# Altium schematic sheet reflex_beta.SchDoc
size C; PageSetup: Record=PageOptions|CenterHorizontal=True|CenterVertical=True|PrintScale=0.53|XCorrection=1.00|YCorrection=1.00|PrintKind=0|BorderSize=5000000|LeftOffset=0|BottomOffset=0|Orientation=2|PaperLength=1000|PaperWidth=1000|Scale=100|PaperSource=7|PrintQuality=-4|MediaType=1|DitherType=10|PrintScaleMode=1|PaperKind=Letter|PaperIndex=1
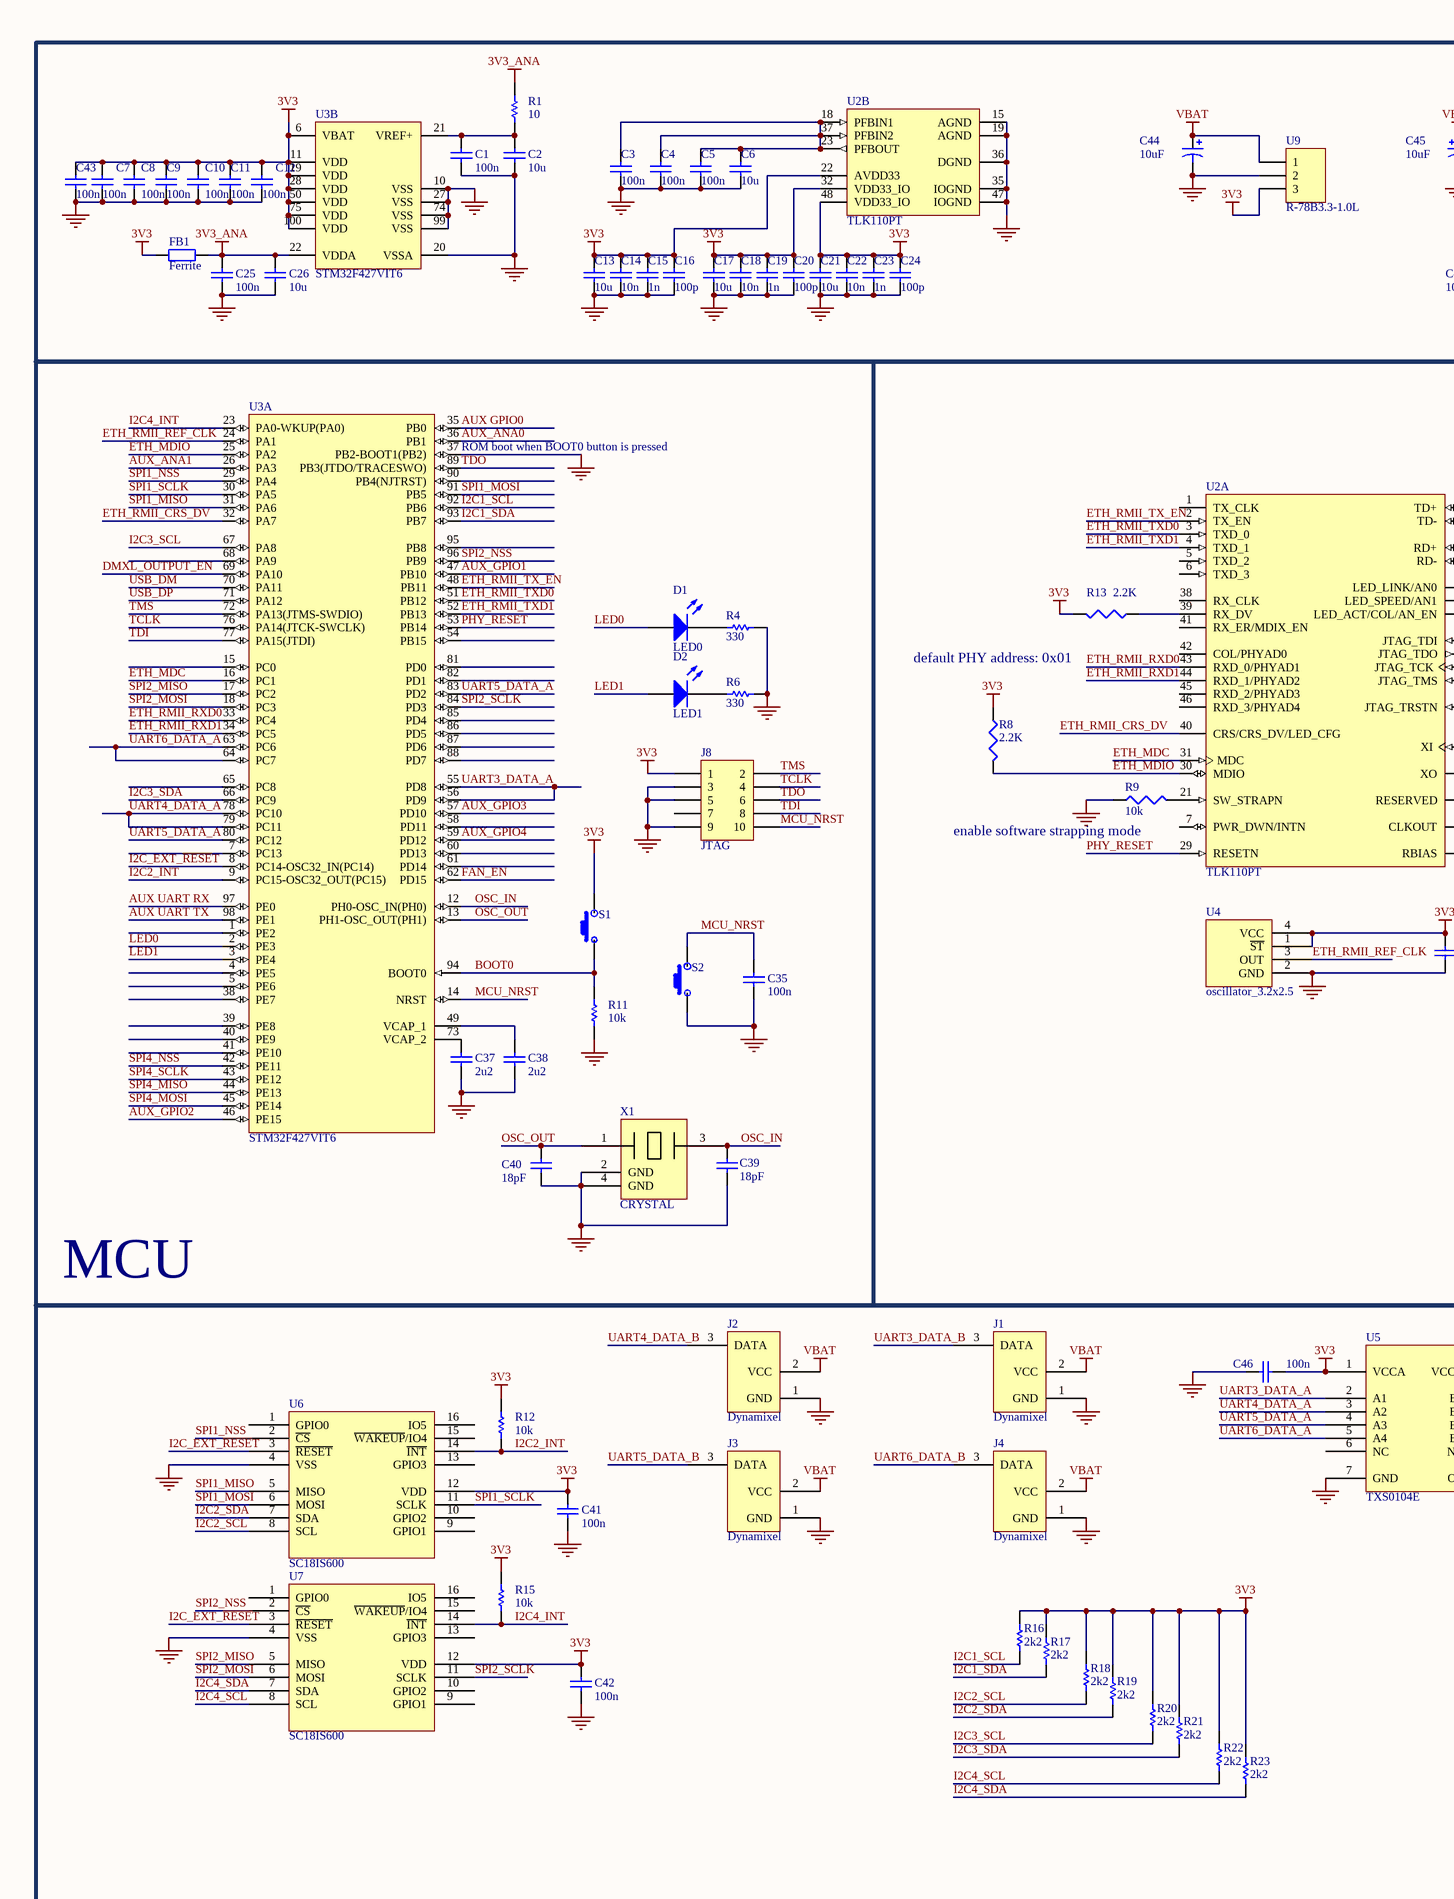
[diagram p0: reflex_beta.SchDoc, left]
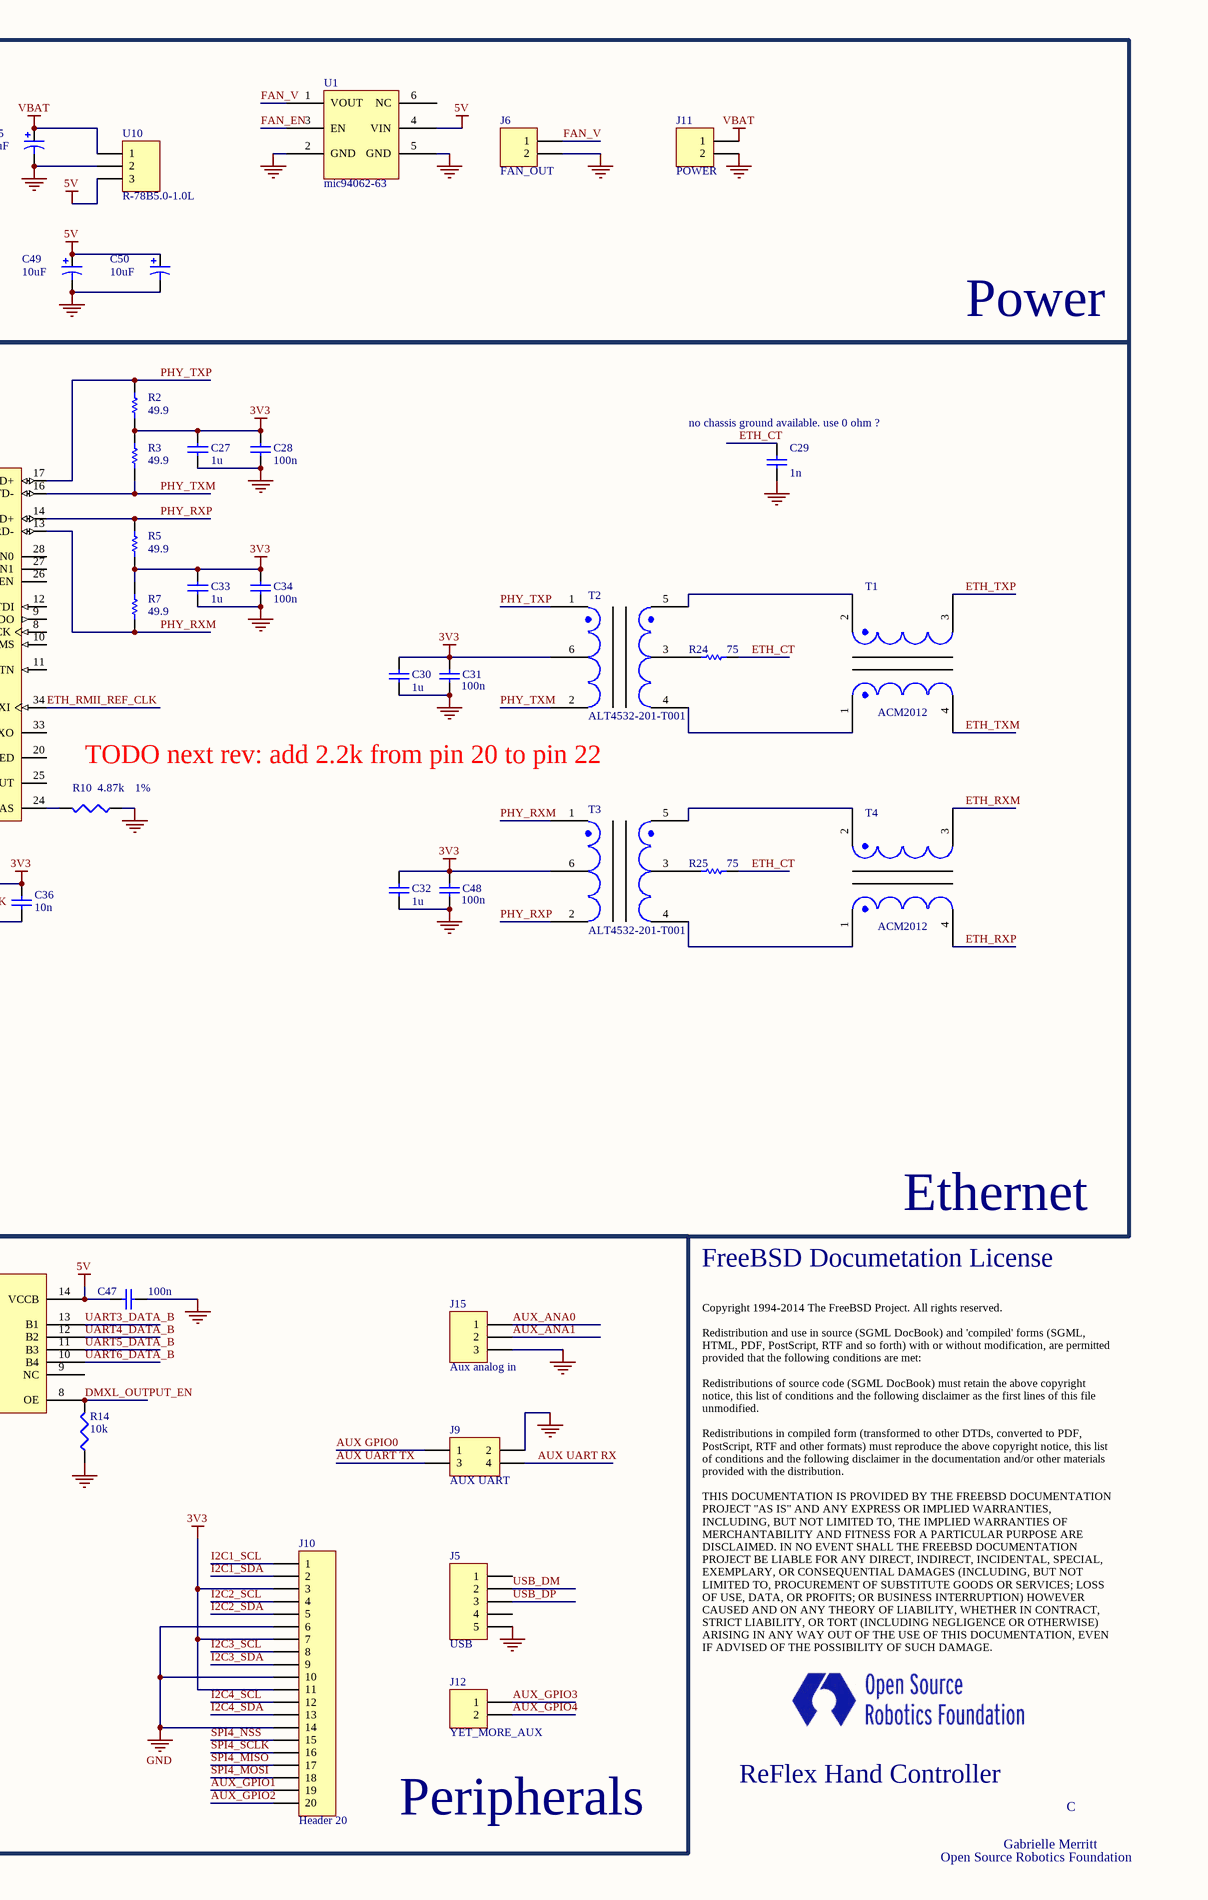
[diagram p1: reflex_beta.SchDoc, right]

## Parts
(Parts that share a designator on the sheet are numbered #1, #2 ... from top to bottom, then left to right.)
C1  value 100n  [GENERIC_0603]  (hidden comment: Cap)
C2  value 10u  [GENERIC_0603]  (hidden comment: Cap)
C3  value 100n  [GENERIC_0603]  (hidden comment: Cap)
C4  value 100n  [GENERIC_0603]  (hidden comment: Cap)
C5  value 100n  [GENERIC_0603]  (hidden comment: Cap)
C6  value 10u  [GENERIC_0603]  (hidden comment: Cap)
C7  value 100n  [GENERIC_0603]  (hidden comment: Cap)
C8  value 100n  [GENERIC_0603]  (hidden comment: Cap)
C9  value 100n  [GENERIC_0603]  (hidden comment: Cap)
C10  value 100n  [GENERIC_0603]  (hidden comment: Cap)
C11  value 100n  [GENERIC_0603]  (hidden comment: Cap)
C12  value 100n  [GENERIC_0603]  (hidden comment: Cap)
C13  value 10u  [GENERIC_0603]  (hidden comment: Cap)
C14  value 10n  [GENERIC_0603]  (hidden comment: Cap)
C15  value 1n  [GENERIC_0603]  (hidden comment: Cap)
C16  value 100p  [GENERIC_0603]  (hidden comment: Cap)
C17  value 10u  [GENERIC_0603]  (hidden comment: Cap)
C18  value 10n  [GENERIC_0603]  (hidden comment: Cap)
C19  value 1n  [GENERIC_0603]  (hidden comment: Cap)
C20  value 100p  [GENERIC_0603]  (hidden comment: Cap)
C21  value 10u  [GENERIC_0603]  (hidden comment: Cap)
C22  value 10n  [GENERIC_0603]  (hidden comment: Cap)
C23  value 1n  [GENERIC_0603]  (hidden comment: Cap)
C24  value 100p  [GENERIC_0603]  (hidden comment: Cap)
C25  value 100n  [GENERIC_0603]  (hidden comment: Cap)
C26  value 10u  [GENERIC_0603]  (hidden comment: Cap)
C27  value 1u  [GENERIC_0603]  (hidden comment: Cap)
C28  value 100n  [GENERIC_0603]  (hidden comment: Cap)
C29  value 1n  [GENERIC_0805]  (hidden comment: Cap)
C30  value 1u  [GENERIC_0402]  (hidden comment: Cap)
C31  value 100n  [GENERIC_0402]  (hidden comment: Cap)
C32  value 1u  [GENERIC_0402]  (hidden comment: Cap)
C33  value 1u  [GENERIC_0603]  (hidden comment: Cap)
C34  value 100n  [GENERIC_0603]  (hidden comment: Cap)
C35  value 100n  [GENERIC_0603]  (hidden comment: Cap)
C36  value 10n  [CAPC0402(1005)60_N]  (hidden comment: CAP 10nF 16V 0402(1005))
C37  value 2u2  [GENERIC_0603]  (hidden comment: Cap)
C38  value 2u2  [GENERIC_0603]  (hidden comment: Cap)
C39  value 18pF  [GENERIC_0603]  (hidden comment: Cap)
C40  value 18pF  [GENERIC_0603]  (hidden comment: Cap)
C41  value 100n  [GENERIC_0603]  (hidden comment: Cap)
C42  value 100n  [GENERIC_0603]  (hidden comment: Cap)
C43  value 100n  [GENERIC_0603]  (hidden comment: Cap)
C44  value 10uF  [GENERIC_0805]  (hidden comment: Cap Pol1)
C45  value 10uF  [GENERIC_0805]  (hidden comment: Cap Pol1)
C46  value 100n  [GENERIC_0603]  (hidden comment: Cap)
C47  value 100n  [GENERIC_0603]  (hidden comment: Cap)
C48  value 100n  [GENERIC_0402]  (hidden comment: Cap)
C49  value 10uF  [GENERIC_0805]  (hidden comment: Cap Pol1)
C50  value 10uF  [GENERIC_0805]  (hidden comment: Cap Pol1)
D1  LED0  [GENERIC_0603]
D2  LED1  [GENERIC_0603]
FB1  Ferrite  [GENERIC_0603]
J1  Dynamixel  [molex_3pos_header]
J2  Dynamixel  [molex_3pos_header]
J3  Dynamixel  [molex_3pos_header]
J4  Dynamixel  [molex_3pos_header]
J5  USB  [FCI-10104110]
J6  FAN_OUT  [HDR1X2]
J8  JTAG  [CNCTECH_3220-10-0300-00]
J9  AUX UART  [HDR2X2]
J10  Header 20  [20pos_halfmm_vert]
J11  POWER  [HDR1X2]
J12  YET_MORE_AUX  [HDR1X2]
J15  Aux analog in  [HDR1X3]
R1  value 10  [GENERIC_0603]  (hidden comment: Res1)
R2  value 49.9  [GENERIC_0603]  (hidden comment: Res1)
R3  value 49.9  [GENERIC_0603]  (hidden comment: Res1)
R4  value 330  [GENERIC_0603]  (hidden comment: Res1)
R5  value 49.9  [GENERIC_0603]  (hidden comment: Res1)
R6  value 330  [GENERIC_0603]  (hidden comment: Res1)
R7  value 49.9  [GENERIC_0603]  (hidden comment: Res1)
R8  value 2.2K  [J1-0603]
R9  value 10k  [J1-0603]
R10  1%  value 4.87k  [GENERIC_0603]
R11  value 10k  [GENERIC_0603]  (hidden comment: Res1)
R12  value 10k  [GENERIC_0603]  (hidden comment: Res1)
R13  value 2.2K  [J1-0603]
R14  value 10k  [GENERIC_0603]
R15  value 10k  [GENERIC_0603]  (hidden comment: Res1)
R16  value 2k2  [GENERIC_0402]  (hidden comment: Res1)
R17  value 2k2  [GENERIC_0402]  (hidden comment: Res1)
R18  value 2k2  [GENERIC_0402]  (hidden comment: Res1)
R19  value 2k2  [GENERIC_0402]  (hidden comment: Res1)
R20  value 2k2  [GENERIC_0402]  (hidden comment: Res1)
R21  value 2k2  [GENERIC_0402]  (hidden comment: Res1)
R22  value 2k2  [GENERIC_0402]  (hidden comment: Res1)
R23  value 2k2  [GENERIC_0402]  (hidden comment: Res1)
R24  value 75  [RESC0402(1005)_L]  (hidden comment: 75R 5% 0402(1005))
R25  value 75  [RESC0402(1005)_L]  (hidden comment: 75R 5% 0402(1005))
S1  Component_1  [EVPAA402_switch]  (value not drawn)
S2  Component_1  [EVPAA402_switch]  (value not drawn)
T1  ACM2012  [ACM2012]
T2  ALT4532-201-T001  [ALT4532-201-T001]
T3  ALT4532-201-T001  [ALT4532-201-T001]
T4  ACM2012  [ACM2012]
U1  mic94062-63  [mic94062-63 sc-70-6]
U2#1  TLK110PT  [TI-PT48_M]  (part B of 2)
U2#2  TLK110PT  [TI-PT48_M]  (part A of 2)
U3  STM32F427VIT6  [STM-LQFP100_N]  (parts A,B of 2)
U4  oscillator_3.2x2.5  [OSCILLATOR_3.2x2.5]
U5  TXS0104E  [TXS0104EPWR]
U6  SC18IS600  [SOP127P600-8N]
U7  SC18IS600  [SOP127P600-8N]
U9  R-78B3.3-1.0L  [R-78HBxx-0.5_HORIZ]
U10  R-78B5.0-1.0L  [R-78HBxx-0.5_HORIZ]
X1  CRYSTAL  [CRYSTAL_2_2.5]

## Blocks framed on the sheet
Power: C1-C26 C43-C45 C49 C50 FB1 J6 J11 R1 U1 U2#1 U3 U9 U10
Ethernet: C27-C34 C36 C48 R2 R3 R5 R7-R10 R13 R24 R25 T1-T4 U2#2 U4
MCU: C35 C37-C40 D1 D2 J8 R4 R6 R11 S1 S2 U3 X1
Peripherals: C41 C42 C46 C47 J1-J5 J9 J10 J12 J15 R12 R14-R23 U5-U7

## Nets
3V3: C7.2 C8.2 C9.2 C10.2 C11.2 C12.2 C13.2 C14.2 C15.2 C16.2 C17.2 C18.2 C19.2 C20.2 C21.2 C22.2 C23.2 C24.2 C27.2 C28.2 C30.2 C31.2 C32.2 C33.2 C34.2 C36.2 C41.2 C42.2 C43.2 C46.1 C48.2 FB1.1 J8.1 J10.3 J10.7 J10.11 R2.1 R3.2 R5.1 R7.2 R8.1 R12.2 R13.2 R15.2 R16.2 R17.2 R18.2 R19.2 R20.2 R21.2 R22.2 R23.2 S1.1 T2.6 T3.6 U2#1.22(AVDD33) U2#1.32(VDD33_IO) U2#1.48(VDD33_IO) U3.6(VBAT) U3.11(VDD) U3.19(VDD) U3.28(VDD) U3.50(VDD) U3.75(VDD) U3.100(VDD) U4.1(~{ST}) U4.4(VCC) U5.1(VCCA) U6.12(VDD) U7.12(VDD) U9.3
3V3_ANA: C25.2 C26.2 FB1.2 R1.2 U3.22(VDDA)
5V: C47.2 C49.1 C50.1 U1.4(VIN) U5.14(VCCB) U10.3
GND: C1.1 C2.1 C3.2 C4.1 C5.1 C6.1 C7.1 C8.1 C9.1 C10.1 C11.1 C12.1 C13.1 C14.1 C15.1 C16.1 C17.1 C18.1 C19.1 C20.1 C21.1 C22.1 C23.1 C24.1 C25.1 C26.1 C27.1 C28.1 C29.1 C30.1 C31.1 C32.1 C33.1 C34.1 C35.1 C36.1 C37.1 C38.1 C39.2 C40.2 C41.1 C42.1 C43.1 C44.2 C45.2 C46.2 C47.1 C48.1 C49.2 C50.2 J1.1(GND) J2.1(GND) J3.1(GND) J4.1(GND) J5.5 J6.2 J8.3 J8.5 J8.9 J9.2 J10.6 J10.10 J10.14 J11.2 J15.3 R4.1 R6.1 R9.1 R10.1 R11.1 R14.1 S2.2 U1.2(GND) U1.5(GND) U2#1.15(AGND) U2#1.19(AGND) U2#1.35(IOGND) U2#1.36(DGND) U2#1.47(IOGND) U3.10(VSS) U3.20(VSSA) U3.27(VSS) U3.37(PB2-BOOT1(PB2)) U3.74(VSS) U3.99(VSS) U4.2(GND) U5.7(GND) U6.4(VSS) U7.4(VSS) U9.2 U10.2 X1.2(GND) X1.4(GND)
VBAT: C44.1 C45.1 J1.2(VCC) J2.2(VCC) J3.2(VCC) J4.2(VCC) J11.1 U9.1 U10.1
AUX GPIO0: J9.1 U3.35(PB0)
AUX UART RX: J9.4 U3.97(PE0)
AUX UART TX: J9.3 U3.98(PE1)
AUX_ANA0: J15.1 U3.36(PB1)
AUX_ANA1: J15.2 U3.26(PA3)
AUX_GPIO1: J10.19 U3.47(PB10)
AUX_GPIO2: J10.20 U3.46(PE15)
AUX_GPIO3: J12.1 U3.57(PD10)
AUX_GPIO4: J12.2 U3.59(PD12)
BOOT0: R11.2 S1.2 U3.94(BOOT0)
DMXL_OUTPUT_EN: R14.2 U3.69(PA10) U5.8(OE)
ETH_CT: C29.2 R24.2 R25.2
ETH_MDC: U2#2.31(MDC) U3.16(PC1)
ETH_MDIO: R8.2 U2#2.30(MDIO) U3.25(PA2)
ETH_RMII_CRS_DV: U2#2.40(CRS/CRS_DV/LED_CFG) U3.32(PA7)
ETH_RMII_REF_CLK: U2#2.34(XI) U3.24(PA1) U4.3(OUT)
ETH_RMII_RXD0: U2#2.43(RXD_0/PHYAD1) U3.33(PC4)
ETH_RMII_RXD1: U2#2.44(RXD_1/PHYAD2) U3.34(PC5)
ETH_RMII_TX_EN: U2#2.2(TX_EN) U3.48(PB11)
ETH_RMII_TXD0: U2#2.3(TXD_0) U3.51(PB12)
ETH_RMII_TXD1: U2#2.4(TXD_1) U3.52(PB13)
ETH_RXM: T4.3
ETH_RXP: T4.4
ETH_TXM: T1.4
ETH_TXP: T1.3
FAN_EN: U1.3(EN) U3.62(PD15)
FAN_V: J6.1 U1.1(VOUT)
I2C1_SCL: J10.1 R16.1 U3.92(PB6)
I2C1_SDA: J10.2 R17.1 U3.93(PB7)
I2C2_INT: R12.1 U3.9(PC15-OSC32_OUT(PC15)) U6.14(~{INT})
I2C2_SCL: J10.4 R18.1 U6.8(SCL)
I2C2_SDA: J10.5 R19.1 U6.7(SDA)
I2C3_SCL: J10.8 R20.1 U3.67(PA8)
I2C3_SDA: J10.9 R21.1 U3.66(PC9)
I2C4_INT: R15.1 U3.23(PA0-WKUP(PA0)) U7.14(~{INT})
I2C4_SCL: J10.12 R22.1 U7.8(SCL)
I2C4_SDA: J10.13 R23.1 U7.7(SDA)
I2C_EXT_~{RESE}T: U3.8(PC14-OSC32_IN(PC14)) U6.3(~{RESET}) U7.3(~{RESET})
LED0: D1.1(A) U3.2(PE3)
LED1: D2.1(A) U3.3(PE4)
MCU_NRST: C35.2 J8.10 S2.1 U3.14(NRST)
OSC_IN: C39.1 U3.12(PH0-OSC_IN(PH0)) X1.3
OSC_OUT: C40.1 U3.13(PH1-OSC_OUT(PH1)) X1.1
PHY_RESET: U2#2.29(RESETN) U3.53(PB14)
PHY_RXM: R7.1 T3.1 U2#2.13(RD-)
PHY_RXP: R5.2 T3.2 U2#2.14(RD+)
PHY_TXM: R3.1 T2.2 U2#2.16(TD-)
PHY_TXP: R2.2 T2.1 U2#2.17(TD+)
SPI1_MISO: U3.31(PA6) U6.5(MISO)
SPI1_MOSI: U3.91(PB5) U6.6(MOSI)
SPI1_NSS: U3.29(PA4) U6.2(~{CS})
SPI1_SCLK: U3.30(PA5) U6.11(SCLK)
SPI2_MISO: U3.17(PC2) U7.5(MISO)
SPI2_MOSI: U3.18(PC3) U7.6(MOSI)
SPI2_NSS: U3.96(PB9) U7.2(~{CS})
SPI2_SCLK: U3.84(PD3) U7.11(SCLK)
SPI4_MISO: J10.17 U3.44(PE13)
SPI4_MOSI: J10.18 U3.45(PE14)
SPI4_NSS: J10.15 U3.42(PE11)
SPI4_SCLK: J10.16 U3.43(PE12)
TCLK: J8.4 U3.76(PA14(JTCK-SWCLK))
TDI: J8.8 U3.77(PA15(JTDI))
TDO: J8.6 U3.89(PB3(JTDO/TRACESWO))
TMS: J8.2 U3.72(PA13(JTMS-SWDIO))
UART3_DATA_A: U3.55(PD8) U3.56(PD9) U5.2(A1)
UART3_DATA_B: J1.3(DATA) U5.13(B1)
UART4_DATA_A: U3.78(PC10) U3.79(PC11) U5.3(A2)
UART4_DATA_B: J2.3(DATA) U5.12(B2)
UART5_DATA_A: U3.80(PC12) U3.83(PD2) U5.4(A3)
UART5_DATA_B: J3.3(DATA) U5.11(B3)
UART6_DATA_A: U3.63(PC6) U3.64(PC7) U5.5(A4)
UART6_DATA_B: J4.3(DATA) U5.10(B4)
USB_DM: J5.2 U3.70(PA11)
USB_DP: J5.3 U3.71(PA12)
NetC1_2: C1.2 C2.2 R1.1 U3.21(VREF+)
NetC3_1: C3.1 C4.2 C5.2 C6.2 U2#1.18(PFBIN1) U2#1.23(PFBOUT) U2#1.37(PFBIN2)
NetC37_2: C37.2 U3.73(VCAP_2)
NetC38_2: C38.2 U3.49(VCAP_1)
NetD1_2: D1.2(K) R4.2
NetD2_2: D2.2(K) R6.2
NetR9_2: R9.2 U2#2.21(SW_STRAPN)
NetR10_2: R10.2 U2#2.24(RBIAS)
NetR13_1: R13.1 U2#2.39(RX_DV)
NetR24_1: R24.1 T2.3
NetR25_1: R25.1 T3.3
NetT1_1: T1.1 T2.4
NetT1_2: T1.2 T2.5
NetT3_4: T3.4 T4.1
NetT3_5: T3.5 T4.2

Not connected (* = marked no-connect by the designer): J5 1 4; J8 7; U1 6(NC); U2#2 1(TX_CLK) 5(TXD_2) 6(TXD_3) 7(PWR_DWN/INTN) 8(JTAG_TCK) 9(JTAG_TDO) 10(JTAG_TMS) 11(JTAG_TRSTN) 12(JTAG_TDI) 20(RESERVED) 25(CLKOUT) 26(LED_ACT/COL/AN_EN) 27(LED_SPEED/AN1) 28(LED_LINK/AN0) 33(XO) 38(RX_CLK) 41(RX_ER/MDIX_EN) 42(COL/PHYAD0) 45(RXD_2/PHYAD3) 46(RXD_3/PHYAD4); U3 1(PE2) 4(PE5) 5(PE6) 7(PC13) 15(PC0) 38(PE7) 39(PE8) 40(PE9) 41(PE10) 54(PB15) 58(PD11) 60(PD13) 61(PD14) 65(PC8) 68(PA9) 81(PD0) 82(PD1) 85(PD4) 86(PD5) 87(PD6) 88(PD7) 90(PB4(NJTRST)) 95(PB8); U5 6(NC) 9(NC); U6 1(GPIO0) 9(GPIO1) 10(GPIO2) 13(GPIO3) 15(~{WAKEUP}/IO4) 16(IO5); U7 1(GPIO0) 9(GPIO1) 10(GPIO2) 13(GPIO3) 15(~{WAKEUP}/IO4) 16(IO5)

## Notes on the sheet
- (near U3) ROM boot when BOOT0 button is pressed
- (near C29) no chassis ground available. use 0 ohm ?
- default PHY address: 0x01
- TODO next rev: add 2.2k from pin 20 to pin 22
- enable software strapping mode
- FreeBSD Documetation License
- Copyright 1994-2014 The FreeBSD Project. All rights reserved.
  Redistribution and use in source (SGML DocBook) and 'compiled' forms (SGML, HTML, PDF, PostScript, RTF and so forth) with or without modification, are permitted provided that the following conditions are met:
  Redistributions of source code (SGML DocBook) must retain the above copyright notice, this list of conditions and the following disclaimer as the first lines of this file unmodified.
  Redistributions in compiled form (transformed to other DTDs, converted to PDF, PostScript, RTF and other formats) must reproduce the above copyright notice, this list of conditions and the following disclaimer in the documentation and/or other materials provided with the distribution.
  THIS DOCUMENTATION IS PROVIDED BY THE FREEBSD DOCUMENTATION PROJECT "AS IS" AND ANY EXPRESS OR IMPLIED WARRANTIES, INCLUDING, BUT NOT LIMITED TO, THE IMPLIED WARRANTIES OF MERCHANTABILITY AND FITNESS FOR A PARTICULAR PURPOSE ARE DISCLAIMED. IN NO EVENT SHALL THE FREEBSD DOCUMENTATION PROJECT BE LIABLE FOR ANY DIRECT, INDIRECT, INCIDENTAL, SPECIAL, EXEMPLARY, OR CONSEQUENTIAL DAMAGES (INCLUDING, BUT NOT LIMITED TO, PROCUREMENT OF SUBSTITUTE GOODS OR SERVICES; LOSS OF USE, DATA, OR PROFITS; OR BUSINESS INTERRUPTION) HOWEVER CAUSED AND ON ANY THEORY OF LIABILITY, WHETHER IN CONTRACT, STRICT LIABILITY, OR TORT (INCLUDING NEGLIGENCE OR OTHERWISE) ARISING IN ANY WAY OUT OF THE USE OF THIS DOCUMENTATION, EVEN IF ADVISED OF THE POSSIBILITY OF SUCH DAMAGE.
- ReFlex Hand Controller
- Gabrielle Merritt
- C
- Open Source Robotics Foundation

## Library data of the parts
C1 C3-C5 C7-C12 C25 C28 C34 C35 C41-C43 C46 C47 = Cap: Capacitor; Manufacturer: TDK Corporation; Manufacturer Part Number: C1608X7R1E104K080AA; Case-EIA: 0603; PackageReference: 0603; Mouser: 810-C1608X7R1E104K
  C28 C34: Published: 8-Jun-2000; LatestRevisionDate: 17-Jul-2002; LatestRevisionNote: Re-released for DXP Platform.; Publisher: Altium Limited; PackageDescription: 0603
C2 C6 C13 C17 C21 C26 = Cap: Capacitor; Manufacturer: TDK Corporation; Manufacturer Part Number: C1608X5R1E106M080AC; Case-EIA: 0603; PackageReference: 0603; Mouser: 810-C1608X5R1E106M
C14 C18 C22 = Cap: Capacitor; Manufacturer: TDK Corporation; Manufacturer Part Number: C1608C0G1H103J080AA; Case-EIA: 0603; PackageReference: 0603; Mouser: 810-C1608C0G1H103J
C15 C19 C23 = Cap: Capacitor; Manufacturer: TDK Corporation; Manufacturer Part Number: C1608X7R2A102K080AA; Case-EIA: 0603; PackageReference: 0603; Mouser: 810-C1608X7R2A102K
C16 C20 C24 = Cap: Capacitor; Manufacturer: TDK Corporation; Manufacturer Part Number: C1608C0G1H101J080AA; Case-EIA: 0603; PackageReference: 0603; Mouser: 810-C1608C0G1H101J
C27 C33 = Cap: Capacitor; Manufacturer: TDK Corporation; Manufacturer Part Number: CGA3E1X7R1E105K080AC; Case-EIA: 0603; Published: 8-Jun-2000; LatestRevisionDate: 17-Jul-2002; LatestRevisionNote: Re-released for DXP Platform.; Publisher: Altium Limited; Mouser: 810-CGA3E1X7R1E105K
  C27: PackageReference: 0603; PackageDescription: 0603
  C33: PackageReference: 0402; PackageDescription: 0402; Distributor Part Number: 445-1265-6-ND
C29 = Cap: Capacitor; Manufacturer: TDK Corporation; Manufacturer Part Number: C2012X7R2E102K085AA; Case-EIA: 0805; Published: 8-Jun-2000; LatestRevisionDate: 17-Jul-2002; LatestRevisionNote: Re-released for DXP Platform.; PackageReference: 0805; Publisher: Altium Limited; PackageDescription: 0805; Distributor Part Number: 445-1265-6-ND; Mouser: 810-C2012X7R2E102K
C30 C32 = Cap: Capacitor; Manufacturer: TDK Corporation; Manufacturer Part Number: C1005X5R1C105K050BC; Published: 8-Jun-2000; LatestRevisionDate: 17-Jul-2002; LatestRevisionNote: Re-released for DXP Platform.; PackageReference: 0402; Publisher: Altium Limited; PackageDescription: 0402; Distributor Part Number: 445-1265-6-ND; Mouser: 810-C1005X5R1C105K
C31 C48 = Cap: Capacitor; Manufacturer: TDK Corporation; Manufacturer Part Number: C1005X5R1A104K050BA; Case-EIA: 0402; Published: 8-Jun-2000; LatestRevisionDate: 17-Jul-2002; LatestRevisionNote: Re-released for DXP Platform.; PackageReference: 0402; Publisher: Altium Limited; PackageDescription: 0402; Distributor Part Number: 445-1265-6-ND; Mouser: 810-C1005X5R1A104K
C36 = CMP-1034-01874-1: CAP 10nF 16V ±5% 0402 (1005 Metric) Thickness 0.6mm SMD; Manufacturer: TDK Corporation; Part Number: C1005X7R1E103K050BB; Manufacturer Part Number: C1005X5R1E103K050BA; Case-EIA: 0402; Case-Metric: 1005; Tolerance: ±5%; Max Thickness: 0.6 mm; Rated Voltage: 16 V; Distributor: Digikey; digikey: 445-1260; Distributor Part Number: 445-1260; Mouser: 810-C1005X5R1E103K; PackageReference: 0402
C37 C38 = Cap: Capacitor; Manufacturer: TDK Corporation; Manufacturer Part Number: C1608X7R1A225K080AC; Case-EIA: 0603; PackageReference: 0603; Mouser: 810-C1608X7R1A225K
C39 C40 = Cap: Capacitor; Manufacturer: TDK Corporation; Manufacturer Part Number: C1608C0G1H180J080AA; Case-EIA: 0603; Published: 8-Jun-2000; LatestRevisionDate: 17-Jul-2002; LatestRevisionNote: Re-released for DXP Platform.; PackageReference: 0603; Publisher: Altium Limited; PackageDescription: 0603; Distributor Part Number: 1276-2210-2-ND; Mouser: 810-C1608C0G1H180J
C44 C45 C49 C50 = Cap Pol1: Polarized Capacitor (Radial); Manufacturer: TDK Corporation; Manufacturer Part Number: C2012X5R1E106M085AC; Case-EIA: 0805; Published: 8-Jun-2000; LatestRevisionDate: 17-Jul-2002; LatestRevisionNote: Re-released for DXP Platform.; PackageReference: 0805; Publisher: Altium Limited; PackageDescription: Polarized Capacitor (Radial); 2 Leads; Distributor Part Number: 445-14388-1-ND; Mouser: 810-C2012X5R1E106MAC
D1 D2 = LED0: Typical INFRARED GaAs LED; Manufacturer: Lite-On; Manufacturer Part Number: LTST-C190GKT; Case-EIA: 0603; PackageReference: 0603; digikey: 160-1183; Mouser: 859-LTST-C190GKT
FB1 = Res2: Resistor; Manufacturer: TDK Corporation; Manufacturer Part Number: MPZ1608S221A; Case-EIA: 0603; PackageReference: 0603; Value: ferrite; Mouser: 810-MPZ1608S221A
J1-J4 = MX-12_3pin_header: Manufacturer: Molex Inc; Manufacturer Part Number: 0022035035; Distributor Part Number: WM18887-ND; Mouser: 538-22-03-5035
J5 = Header 5: Header, 5-Pin; Manufacturer: FCI; Manufacturer Part Number: 10104110-0001LF; LatestRevisionDate: 17-Jul-2002; LatestRevisionNote: Re-released for DXP Platform.; Publisher: Altium Limited; PackageDescription: Micro USB B; mouser: 649-10104110-0001LF
J6 J12 = Header 2: Header, 2-Pin; Manufacturer Part Number: 77311-118-02LF; LatestRevisionDate: 17-Jul-2002; LatestRevisionNote: Re-released for DXP Platform.; Publisher: Altium Limited; Mouser: 649-77311-118-02LF
J8 = Header 5X2: Header, 5-Pin, Dual row; Manufacturer: FCI; Manufacturer Part Number: 20021121-00010T4LF; LatestRevisionDate: 17-Jul-2002; LatestRevisionNote: Re-released for DXP Platform.; Publisher: Altium Limited; Distributor Part Number: 649-221121-00010T4LF; Distributor: mouser; Mouser: 649-221121-00010T4LF
J9 = Header 2X2: Header, 2-Pin, Dual row; Manufacturer Part Number: 67996-104HLF; LatestRevisionDate: 17-Jul-2002; LatestRevisionNote: Re-released for DXP Platform.; Publisher: Altium Limited; Mouser: 649-67996-104HLF
J10 = Header 20: Header, 20-Pin; Manufacturer Part Number: 62674-201121ALF; Manufacturer: FCI; LatestRevisionDate: 17-Jul-2002; LatestRevisionNote: Re-released for DXP Platform.; Publisher: Altium Limited; Mouser: 649-62674-201121ALF
J11 = Header 2: Header, 2-Pin; Manufacturer: FCI; Manufacturer Part Number: 77311-118-02LF; LatestRevisionDate: 17-Jul-2002; LatestRevisionNote: Re-released for DXP Platform.; Publisher: Altium Limited; Mouser: 649-77311-118-02LF
J15 = Header 3: Header, 3-Pin; Manufacturer Part Number: 77311-118-03LF; LatestRevisionDate: 17-Jul-2002; LatestRevisionNote: Re-released for DXP Platform.; Publisher: Altium Limited; Mouser: 649-77311-118-03LF
R1 = Res1: Resistor; Manufacturer: Vishay / Dale; Manufacturer Part Number: CRCW060310R0FKEA; Case-EIA: 0603; PackageReference: 0603; Mouser: 71-CRCW0603-10-E3
R2 R3 R5 R7 = Res1: Resistor; Manufacturer: Vishay / Dale; Manufacturer Part Number: CRCW060349R9FKEA; Case-EIA: 0603; PackageReference: 0603; Mouser: 71-CRCW0603-49.9-E3
R4 R6 = Res1: Resistor; Manufacturer: Vishay / Dale; Manufacturer Part Number: CRCW0603330RFKEA; Case-EIA: 0603; PackageReference: 0603; Mouser: 71-CRCW0603-330-E3
R8 R13 = Res3: Resistor; Manufacturer: Vishay / Dale; Manufacturer Part Number: CRCW06032K20FKEA; Case-EIA: 0603; Published: 8-Jun-2000; LatestRevisionDate: 29-May-2009; LatestRevisionNote: IPC-7351 Footprint Added.; PackageReference: J1-0603; Publisher: Altium Limited; PackageDescription: Chip Resistor; Distributor Part Number: RHM1.00KADCT-ND; Mouser: 71-CRCW0603-2.2K-E3
R9 R14 = Res3: Resistor; Manufacturer: Vishay / Dale; Manufacturer Part Number: CRCW060310K0FKEA; Case-EIA: 0603; Published: 8-Jun-2000; LatestRevisionDate: 29-May-2009; LatestRevisionNote: IPC-7351 Footprint Added.; PackageReference: 0603; Publisher: Altium Limited; PackageDescription: Chip Resistor; Distributor Part Number: RHM1.00KADCT-ND; Mouser: 71-CRCW0603-10K-E3
R10 = Res3: Resistor; Manufacturer: Yageo; Manufacturer Part Number: RC0603FR-074K87L; Case-EIA: 0603; Published: 8-Jun-2000; LatestRevisionDate: 29-May-2009; LatestRevisionNote: IPC-7351 Footprint Added.; PackageReference: J1-0603; Publisher: Altium Limited; PackageDescription: Chip Resistor; Distributor Part Number: 311-4.87KHRCT-ND; Mouser: 603-RC0603FR-074K87L
R11 R12 R15 = Res1: Resistor; Manufacturer: Vishay / Dale; Manufacturer Part Number: CRCW060310K0FKEA; Case-EIA: 0603; PackageReference: 0603; Mouser: 71-CRCW0603-10K-E3
R16-R23 = Res1: Resistor; Manufacturer: Vishay / Dale; Manufacturer Part Number: CRCW04022K20JNEDHP; Published: 8-Jun-2000; LatestRevisionDate: 17-Jul-2002; LatestRevisionNote: Re-released for DXP Platform.; PackageReference: 0402; Publisher: Altium Limited; PackageDescription: Axial Device, Thru-Hole; 2 Leads; 0.3 in Pin Spacing
  R16: mouser: 71-CRCW04022K20JNEDH
  R17-R23: Mouser: 71-CRCW04022K20JNEDH
R24 R25 = CMP-1011-00047-1: 75R 0.063W 5% 0402 (1005 Metric)  SMD; Manufacturer: Vishay / Dale; Manufacturer Part Number: CRCW040275R0FKED; Case-Metric: 1005; Case-EIA: 0402; Power: 0.063 W; Tolerance: 5 %; Technology: SMT; Mouser: 71-CRCW0402-75-E3
S1 = Component_1: Manufacturer: Panasonic; Manufacturer Part Number: EVP-AA402W; mouser: 667-EVP-AA402W
S2 = Component_1: Manufacturer Part Number: EVP-AA402W; Manufacturer: Panasonic; mouser: 667-EVP-AA402W
T1 T4 = ACM2012: Manufacturer: TDK Corporation; Manufacturer Part Number: ACM2012-900-2P-T002; Mouser: 810-ACM20129002PT002
  T1: Distributor Part Number: 445-2207
T2 T3 = ALT4532-201-T001: Manufacturer: TDK Corporation; Manufacturer Part Number: ALT4532-201-T001; Mouser: 810-ALT4532-201-T001
U1 = mic94062-63: Manufacturer: Micrel; Manufacturer Part Number: MIC94062YC6 TR; mouser: 998-MIC94062YC6TR; Mouser: 998-MIC94062YC6TR
U2#1 = CMP-0302-00001-1: Industrial Temp, Single Port 10/100 Mb/s Ethernet Physical Layer Transceiver, -40 to 85 degC, 48-Pin LQFP (PT), Green (RoHS & no Sb/Br); Cable Length(m): 150; Special Features: Cable Diagnostics; LED(#): 3; SupplyVoltage(Volt): 3.3; SubFamily: PHY; Interface: MII, RMII; JTAG1149.1: Yes; ComponentLink1Description: Manufacturer URL; PackageVersion: revC, Nov-1996; PackageDescription: 48-Pin Plastic Quad Flat Pack, 7 x 7 mm Body, 0.5 mm Pitch; ComponentLink1URL: www.ti.com; PackageReference: PT48; ComponentLink2URL: http://www.ti.com/general/docs/lit/getliterature.tsp?genericPartNumber=TLK110&fileType=pdf; ComponentLink3Description: Package Specification; ComponentLink2Description: Datasheet; ComponentLink3URL: http://www.ti.com/litv/pdf/mtqf003a; Port Count: Single; DatasheetVersion: SLLS901A; mouser: 595-TLK110PT
U2#2 = CMP-0302-00001-1: Industrial Temp, Single Port 10/100 Mb/s Ethernet Physical Layer Transceiver, -40 to 85 degC, 48-Pin LQFP (PT), Green (RoHS & no Sb/Br); Manufacturer: Texas Instruments; Cable Length(m): 150; Special Features: Cable Diagnostics; LED(#): 3; SupplyVoltage(Volt): 3.3; SubFamily: PHY; Interface: MII, RMII; JTAG1149.1: Yes; ComponentLink1Description: Manufacturer URL; PackageVersion: revC, Nov-1996; PackageDescription: 48-Pin Plastic Quad Flat Pack, 7 x 7 mm Body, 0.5 mm Pitch; ComponentLink1URL: www.ti.com; PackageReference: PT48; ComponentLink2URL: http://www.ti.com/general/docs/lit/getliterature.tsp?genericPartNumber=TLK110&fileType=pdf; ComponentLink3Description: Package Specification; ComponentLink2Description: Datasheet; ComponentLink3URL: http://www.ti.com/litv/pdf/mtqf003a; Port Count: Single; DatasheetVersion: SLLS901A; Mouser: 595-TLK110PT; Manufacturer Part Number: TLK110PT
U3 = CMP-0243-00027-2: ARM Cortex-M4 32-bit MCU+FPU, 210 DMIPS, 2048 kB Flash, 256 kB Internal RAM, 82 I/Os, 100-pin LQFP, -40 to 85 degC, Tray; Manufacturer: STMicroelectronics; D/A Converter: 2x12-bit; FLASH Size (Prog) (kB): 2048; I/Os (High Current): 82; Internal RAM Size (kB): 256; Supply Voltage(Vcc) min (V): 1.8; Supply Voltage(Vcc) max (V): 3.6; Operating Frequency(F) (Processor speed) (MHz): 168; Core: ARM Cortex-M4; Mounting Technology: Surface Mount; ComponentLink1URL: http://www.st.com/web/en/home.html; ComponentLink3Description: Package Specification; DatasheetVersion: Rev. 1; ComponentLink3URL: http://www.st.com/st-web-ui/static/active/en/resource/technical/document/data_brief/DM00071938.pdf; ComponentLink2Description: Datasheet; PartNumber: STM32F427VIT6; PackageReference: LQFP100; PackageVersion: Rev. 1, 06/2013; ComponentLink1Description: Manufacturer URL; ComponentLink2URL: http://www.st.com/st-web-ui/static/active/en/resource/technical/document/datasheet/DM00071990.pdf; Packing: Tray; PackageDescription: 100-Pin Low Profile Quad Flat Package, 14 x 14 mm Body, 0.5 mm Pitch; Manufacturer Part Number: STM32F427VIT6; Mouser: 511-STM32F427VIT6
U4 = oscillator_3.2x2.5: Manufacturer: Abracon; Part Number: ASE-50.000MHZ-LCT; digikey: 535-9577; Distributor: Digikey; Distributor Part Number: 535-9577; Manufacturer Part Number: ASE-50.000MHZ-LCT; Mouser: 815-ASE-50.000MLCT
U5 = Component_1: mouser: 595-TXS0104EPWR; Manufacturer Part Number: TXS0104EPWR
U6 U7 = Component_1: Manufacturer Number: SC18IS600IPW,112; Manufacturer Part Number: SC18IS600IPW
  U6: Mouser: 771-SC18IS600IPW
  U7: mouser: 771-SC18IS600IPW
U9 U10 = Header 3: Header, 3-Pin; Manufacturer: Recom Power; LatestRevisionDate: 17-Jul-2002; LatestRevisionNote: Re-released for DXP Platform.; Publisher: Altium Limited
  U9: Distributor Part Number: 945-1050-ND; Manufacturer Part Number: R-78B3.3-1.0L; Mouser: 919-R-78B3.3-1.0L
  U10: Distributor Part Number: 945-1053-ND; Manufacturer Part Number: R-78B5.0-1.0L; Mouser: 919-R-78B5.0-1.0L
X1 = CRYSTAL: Manufacturer: TXC Corporation; Manufacturer Part Number: 8Z-25.000MEEQ-T; Value: 25 MHZ; Distributor Part Number: 887-1339-1-ND; PackageDescription: 2 2.5; PackageReference: 2 2.5; Mouser: 717-8Z-25.000MEEQ-T